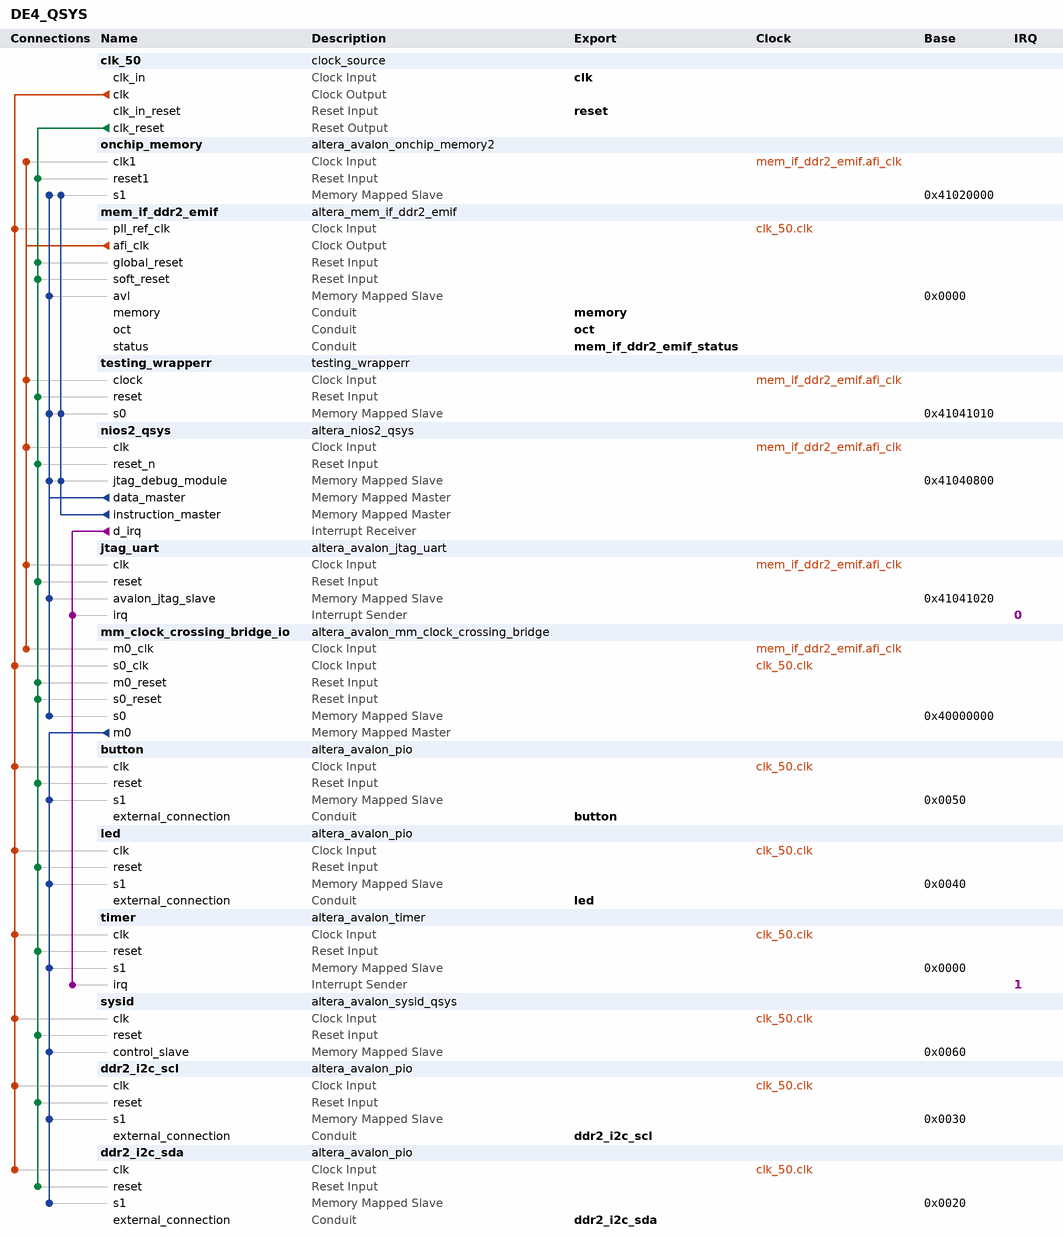
[diagram p0: system contents]
# Platform Designer (Qsys) system DE4_QSYS, Stratix IV EP4SGX530KH40C2
# Parameters at their usual value, and those the tool derives, are not listed.
package require -exact qsys 13.0.1.99.2
create_system DE4_QSYS
set_project_property DEVICE_FAMILY {Stratix IV}
set_project_property DEVICE EP4SGX530KH40C2

add_instance clk_50 clock_source 13.0
set_instance_parameter_value clk_50 clockFrequency 50000000

add_instance onchip_memory altera_avalon_onchip_memory2 13.0.1.99.2
set_instance_parameter_value onchip_memory dataWidth 32
set_instance_parameter_value onchip_memory dualPort false
set_instance_parameter_value onchip_memory initMemContent true
set_instance_parameter_value onchip_memory initializationFileName onchip_memory
set_instance_parameter_value onchip_memory memorySize 128000

add_instance mem_if_ddr2_emif altera_mem_if_ddr2_emif 13.0
set_instance_parameter_value mem_if_ddr2_emif MEM_CLK_FREQ 300.0
set_instance_parameter_value mem_if_ddr2_emif MEM_ROW_ADDR_WIDTH 14
set_instance_parameter_value mem_if_ddr2_emif MEM_COL_ADDR_WIDTH 10
set_instance_parameter_value mem_if_ddr2_emif MEM_DQ_WIDTH 64
set_instance_parameter_value mem_if_ddr2_emif MEM_BANKADDR_WIDTH 3
set_instance_parameter_value mem_if_ddr2_emif MEM_NUMBER_OF_RANKS_PER_DIMM 1
set_instance_parameter_value mem_if_ddr2_emif MEM_TCL 6
set_instance_parameter_value mem_if_ddr2_emif TIMING_TIH 375
set_instance_parameter_value mem_if_ddr2_emif TIMING_TDQSQ 200
set_instance_parameter_value mem_if_ddr2_emif TIMING_TQHS 300
set_instance_parameter_value mem_if_ddr2_emif MEM_TRAS_NS 40.0
set_instance_parameter_value mem_if_ddr2_emif POWER_OF_TWO_BUS false
set_instance_parameter_value mem_if_ddr2_emif AVL_MAX_SIZE 4
set_instance_parameter_value mem_if_ddr2_emif REF_CLK_FREQ 50.0
set_instance_parameter_value mem_if_ddr2_emif DEFAULT_FAST_SIM_MODEL true
set_instance_parameter_value mem_if_ddr2_emif PLL_SHARING_MODE None
set_instance_parameter_value mem_if_ddr2_emif EXPORT_AFI_HALF_CLK false
set_instance_parameter_value mem_if_ddr2_emif CALIBRATION_MODE Full
set_instance_parameter_value mem_if_ddr2_emif USER_DEBUG_LEVEL 0
set_instance_parameter_value mem_if_ddr2_emif DLL_SHARING_MODE None

add_instance testing_wrapperr testing_wrapperr 1.0
set_instance_parameter_value testing_wrapperr DATAWIDTH 32
set_instance_parameter_value testing_wrapperr ADDRESS_WIDTH 32

add_instance nios2_qsys altera_nios2_qsys 13.0
set_instance_parameter_value nios2_qsys manuallyAssignCpuID false
set_instance_parameter_value nios2_qsys resetSlave onchip_memory.s1
set_instance_parameter_value nios2_qsys exceptionSlave onchip_memory.s1
set_instance_parameter_value nios2_qsys breakSlave nios2_qsys.jtag_debug_module
set_instance_parameter_value nios2_qsys muldiv_multiplierType DSPBlock
set_instance_parameter_value nios2_qsys impl Fast
set_instance_parameter_value nios2_qsys icache_size 4096
set_instance_parameter_value nios2_qsys dcache_bursts true

add_instance jtag_uart altera_avalon_jtag_uart 13.0.1.99.2
set_instance_parameter_value jtag_uart allowMultipleConnections true
set_instance_parameter_value jtag_uart simInteractiveOptions INTERACTIVE_ASCII_OUTPUT

add_instance mm_clock_crossing_bridge_io altera_avalon_mm_clock_crossing_bridge 13.0
set_instance_parameter_value mm_clock_crossing_bridge_io DATA_WIDTH 32
set_instance_parameter_value mm_clock_crossing_bridge_io ADDRESS_WIDTH 10
set_instance_parameter_value mm_clock_crossing_bridge_io MAX_BURST_SIZE 1
set_instance_parameter_value mm_clock_crossing_bridge_io COMMAND_FIFO_DEPTH 4
set_instance_parameter_value mm_clock_crossing_bridge_io RESPONSE_FIFO_DEPTH 4
set_instance_parameter_value mm_clock_crossing_bridge_io MASTER_SYNC_DEPTH 2
set_instance_parameter_value mm_clock_crossing_bridge_io SLAVE_SYNC_DEPTH 2

add_instance button altera_avalon_pio 13.0.1.99.2
set_instance_parameter_value button direction Input
set_instance_parameter_value button width 4

add_instance led altera_avalon_pio 13.0.1.99.2
set_instance_parameter_value led direction Output
set_instance_parameter_value led width 8

add_instance timer altera_avalon_timer 13.0.1.99.2
set_instance_parameter_value timer period 1
set_instance_parameter_value timer periodUnits MSEC

add_instance sysid altera_avalon_sysid_qsys 13.0
set_instance_parameter_value sysid id 0

add_instance ddr2_i2c_scl altera_avalon_pio 13.0.1.99.2
set_instance_parameter_value ddr2_i2c_scl direction Output
set_instance_parameter_value ddr2_i2c_scl width 1

add_instance ddr2_i2c_sda altera_avalon_pio 13.0.1.99.2
set_instance_parameter_value ddr2_i2c_sda direction Bidir
set_instance_parameter_value ddr2_i2c_sda width 1

# connections
add_connection clk_50.clk button.clk clock
add_connection clk_50.clk ddr2_i2c_scl.clk clock
add_connection clk_50.clk ddr2_i2c_sda.clk clock
add_connection clk_50.clk led.clk clock
add_connection clk_50.clk mem_if_ddr2_emif.pll_ref_clk clock
add_connection clk_50.clk mm_clock_crossing_bridge_io.s0_clk clock
add_connection clk_50.clk sysid.clk clock
add_connection clk_50.clk timer.clk clock
add_connection mem_if_ddr2_emif.afi_clk jtag_uart.clk clock
add_connection mem_if_ddr2_emif.afi_clk mm_clock_crossing_bridge_io.m0_clk clock
add_connection mem_if_ddr2_emif.afi_clk nios2_qsys.clk clock
add_connection mem_if_ddr2_emif.afi_clk onchip_memory.clk1 clock
add_connection mem_if_ddr2_emif.afi_clk testing_wrapperr.clock clock
add_connection clk_50.clk_reset button.reset reset
add_connection clk_50.clk_reset ddr2_i2c_scl.reset reset
add_connection clk_50.clk_reset ddr2_i2c_sda.reset reset
add_connection clk_50.clk_reset jtag_uart.reset reset
add_connection clk_50.clk_reset led.reset reset
add_connection clk_50.clk_reset mem_if_ddr2_emif.global_reset reset
add_connection clk_50.clk_reset mem_if_ddr2_emif.soft_reset reset
add_connection clk_50.clk_reset mm_clock_crossing_bridge_io.m0_reset reset
add_connection clk_50.clk_reset mm_clock_crossing_bridge_io.s0_reset reset
add_connection clk_50.clk_reset nios2_qsys.reset_n reset
add_connection clk_50.clk_reset onchip_memory.reset1 reset
add_connection clk_50.clk_reset sysid.reset reset
add_connection clk_50.clk_reset testing_wrapperr.reset reset
add_connection clk_50.clk_reset timer.reset reset
add_connection mm_clock_crossing_bridge_io.m0 button.s1 avalon
set_connection_parameter_value mm_clock_crossing_bridge_io.m0/button.s1 baseAddress 0x0050
add_connection mm_clock_crossing_bridge_io.m0 ddr2_i2c_scl.s1 avalon
set_connection_parameter_value mm_clock_crossing_bridge_io.m0/ddr2_i2c_scl.s1 baseAddress 0x0030
add_connection mm_clock_crossing_bridge_io.m0 ddr2_i2c_sda.s1 avalon
set_connection_parameter_value mm_clock_crossing_bridge_io.m0/ddr2_i2c_sda.s1 baseAddress 0x0020
add_connection mm_clock_crossing_bridge_io.m0 led.s1 avalon
set_connection_parameter_value mm_clock_crossing_bridge_io.m0/led.s1 baseAddress 0x0040
add_connection mm_clock_crossing_bridge_io.m0 sysid.control_slave avalon
set_connection_parameter_value mm_clock_crossing_bridge_io.m0/sysid.control_slave baseAddress 0x0060
add_connection mm_clock_crossing_bridge_io.m0 timer.s1 avalon
set_connection_parameter_value mm_clock_crossing_bridge_io.m0/timer.s1 baseAddress 0x0000
add_connection nios2_qsys.data_master jtag_uart.avalon_jtag_slave avalon
set_connection_parameter_value nios2_qsys.data_master/jtag_uart.avalon_jtag_slave baseAddress 0x41041020
add_connection nios2_qsys.data_master mem_if_ddr2_emif.avl avalon
set_connection_parameter_value nios2_qsys.data_master/mem_if_ddr2_emif.avl baseAddress 0x0000
add_connection nios2_qsys.data_master mm_clock_crossing_bridge_io.s0 avalon
set_connection_parameter_value nios2_qsys.data_master/mm_clock_crossing_bridge_io.s0 baseAddress 0x40000000
add_connection nios2_qsys.data_master nios2_qsys.jtag_debug_module avalon
set_connection_parameter_value nios2_qsys.data_master/nios2_qsys.jtag_debug_module baseAddress 0x41040800
add_connection nios2_qsys.data_master onchip_memory.s1 avalon
set_connection_parameter_value nios2_qsys.data_master/onchip_memory.s1 baseAddress 0x41020000
add_connection nios2_qsys.data_master testing_wrapperr.s0 avalon
set_connection_parameter_value nios2_qsys.data_master/testing_wrapperr.s0 baseAddress 0x41041010
add_connection nios2_qsys.instruction_master nios2_qsys.jtag_debug_module avalon
set_connection_parameter_value nios2_qsys.instruction_master/nios2_qsys.jtag_debug_module baseAddress 0x41040800
add_connection nios2_qsys.instruction_master onchip_memory.s1 avalon
set_connection_parameter_value nios2_qsys.instruction_master/onchip_memory.s1 baseAddress 0x41020000
add_connection nios2_qsys.instruction_master testing_wrapperr.s0 avalon
set_connection_parameter_value nios2_qsys.instruction_master/testing_wrapperr.s0 baseAddress 0x41041010
add_connection nios2_qsys.d_irq jtag_uart.irq interrupt
set_connection_parameter_value nios2_qsys.d_irq/jtag_uart.irq irqNumber 0
add_connection nios2_qsys.d_irq timer.irq interrupt
set_connection_parameter_value nios2_qsys.d_irq/timer.irq irqNumber 1

# exported interfaces
add_interface clk clock sink
set_interface_property clk EXPORT_OF clk_50.clk_in
add_interface reset reset sink
set_interface_property reset EXPORT_OF clk_50.clk_in_reset
add_interface memory conduit end
set_interface_property memory EXPORT_OF mem_if_ddr2_emif.memory
add_interface oct conduit end
set_interface_property oct EXPORT_OF mem_if_ddr2_emif.oct
add_interface mem_if_ddr2_emif_status conduit end
set_interface_property mem_if_ddr2_emif_status EXPORT_OF mem_if_ddr2_emif.status
add_interface led conduit end
set_interface_property led EXPORT_OF led.external_connection
add_interface button conduit end
set_interface_property button EXPORT_OF button.external_connection
add_interface ddr2_i2c_scl conduit end
set_interface_property ddr2_i2c_scl EXPORT_OF ddr2_i2c_scl.external_connection
add_interface ddr2_i2c_sda conduit end
set_interface_property ddr2_i2c_sda EXPORT_OF ddr2_i2c_sda.external_connection

set_interconnect_requirement {$system} qsys_mm.clockCrossingAdapter HANDSHAKE
set_interconnect_requirement {$system} qsys_mm.maxAdditionalLatency 1

save_system DE4_QSYS.qsys
